# Altium project 2022_02_11_LED_Driver_PCB.PrjPcb
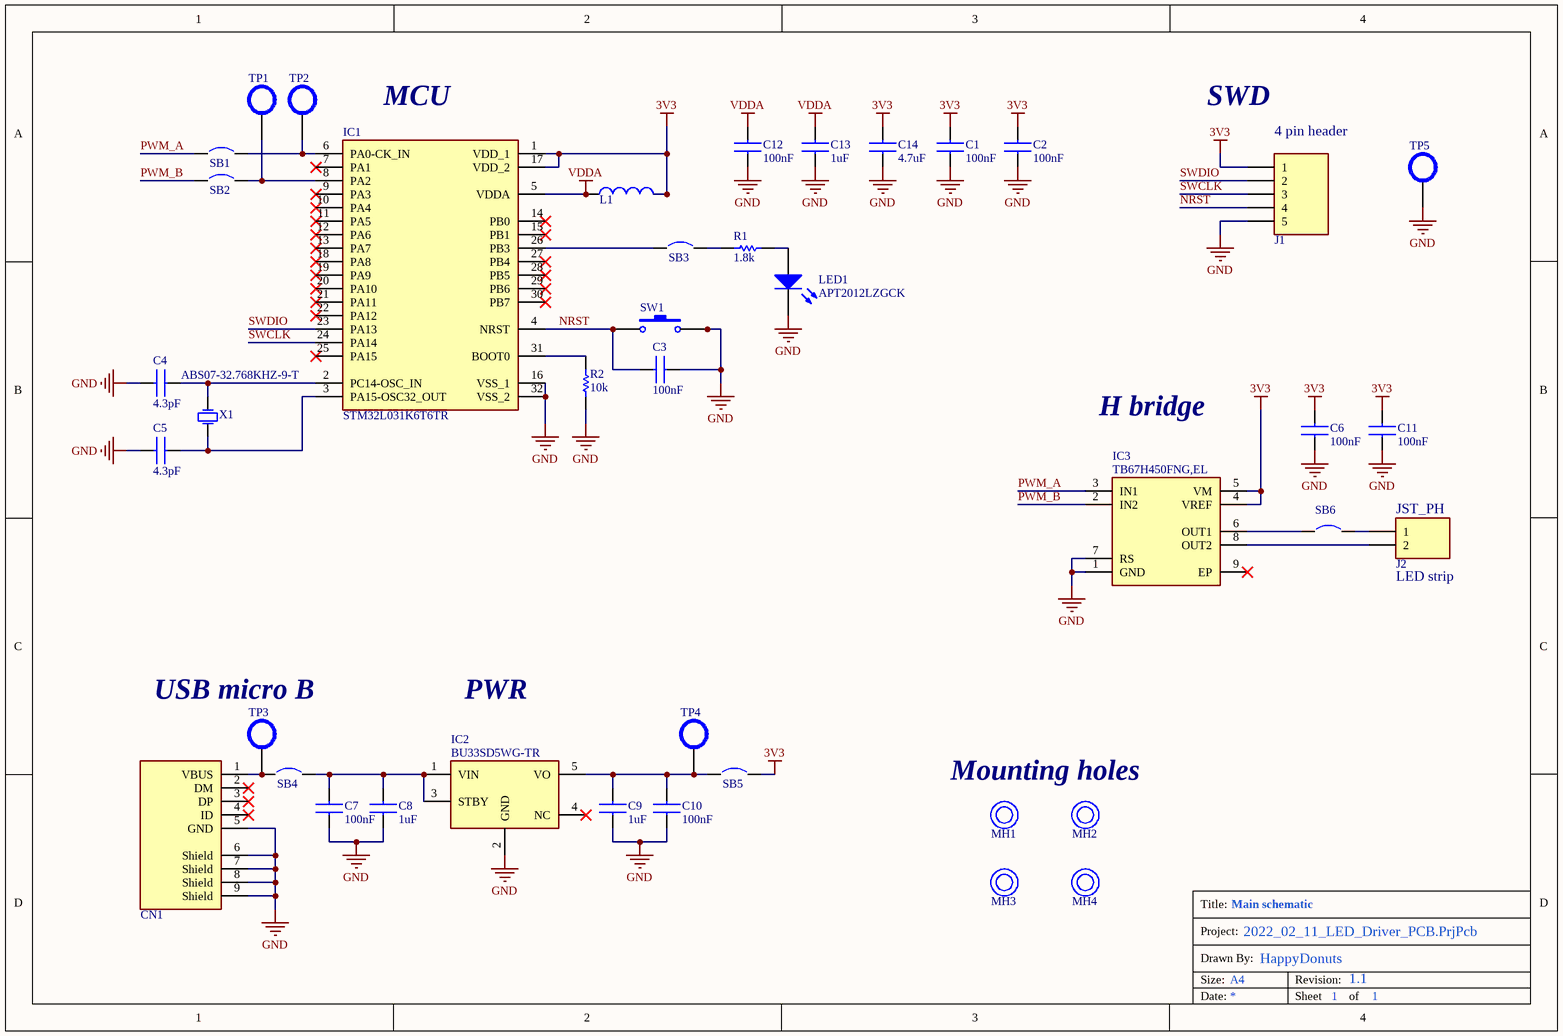
[diagram p0: main.SchDoc]
1 sheet, 41 parts. Net scope: global (net labels, ports and power ports of the same name join across sheets).
Board file: PCB1.PcbDoc

## Sheet main.SchDoc: Main schematic
size A4; Author: HappyDonuts; Revision: 1.1; SheetNumber: 1; SheetTotal: 1

### Parts
C1  value 100nF  [CAPC2012X94N]  (hidden comment: C0805C104K5RAC7411)
C2  value 100nF  [CAPC2012X94N]  (hidden comment: C0805C104K5RAC7411)
C3  value 100nF  [CAPC2012X94N]  (hidden comment: C0805C104K5RAC7411)
C4  value 4.3pF  [CAPC2012X94N]  (hidden comment: 08055A4R3CAT2A)
C5  value 4.3pF  [CAPC2012X94N]  (hidden comment: 08055A4R3CAT2A)
C6  value 100nF  [CAPC2012X94N]  (hidden comment: C0805C104K5RAC7411)
C7  value 100nF  [CAPC2012X94N]  (hidden comment: C0805C104K5RAC7411)
C8  value 1uF  [CAPC2012X135N]  (hidden comment: 885012107015)
C9  value 1uF  [CAPC2012X135N]  (hidden comment: 885012107015)
C10  value 100nF  [CAPC2012X94N]  (hidden comment: C0805C104K5RAC7411)
C11  value 100nF  [CAPC2012X94N]  (hidden comment: C0805C104K5RAC7411)
C12  value 100nF  [CAPC2012X94N]  (hidden comment: C0805C104K5RAC7411)
C13  value 1uF  [CAPC2012X135N]  (hidden comment: 885012107015)
C14  value 4.7uF  [CAPC2012X135N]  (hidden comment: CL21A475KPFNNNE)
CN1  920-E52A2021S10100  [USB307530A]  (value not drawn)
IC1  STM32L031K6T6TR  [QFP80P900X900X160-32N]
IC2  BU33SD5WG-TR  [SOT95P280X125-5N]
IC3  TB67H450FNG,EL  [SOIC127P600X175-9N]
J1  5PIN  [5PIN]  (value not drawn)
J2  B2B-PH-K-S_LF__SN_  [SHDR2W50P0X200_1X2_590X450X600P]  (value not drawn)
L1  742792030  [RESC2012X60N]  (value not drawn)
LED1  APT2012LZGCK  [LEDC2012X85N]
MH1  MOUNTING_HOLE_NP  [MOUNTING_HOLE_NP]  (value not drawn)  (no BOM)
MH2  MOUNTING_HOLE_NP  [MOUNTING_HOLE_NP]  (value not drawn)  (no BOM)
MH3  MOUNTING_HOLE_NP  [MOUNTING_HOLE_NP]  (value not drawn)  (no BOM)
MH4  MOUNTING_HOLE_NP  [MOUNTING_HOLE_NP]  (value not drawn)  (no BOM)
R1  value 1.8k  [RESC2012X60N]  (hidden comment: RC0805FR-071K8L)
R2  value 10k  [RESC2012X60N]  (hidden comment: RC0805FR-0710KL)
SB1  RC0805FR-070RL  [RESC2012X60N]  (value not drawn)
SB2  RC0805FR-070RL  [RESC2012X60N]  (value not drawn)
SB3  RC0805FR-070RL  [RESC2012X60N]  (value not drawn)
SB4  RC0805FR-070RL  [RESC2012X60N]  (value not drawn)
SB5  RC0805FR-070RL  [RESC2012X60N]  (value not drawn)
SB6  RC0805FR-070RL  [RESC2012X60N]  (value not drawn)
SW1  EVP-BT3G4A000  [EVP-BT3G4A000]  (value not drawn)
TP1  TEST_POINT  [TEST_POINT]  (value not drawn)  (no BOM)
TP2  TEST_POINT  [TEST_POINT]  (value not drawn)  (no BOM)
TP3  TEST_POINT  [TEST_POINT]  (value not drawn)  (no BOM)
TP4  TEST_POINT  [TEST_POINT]  (value not drawn)  (no BOM)
TP5  TEST_POINT  [TEST_POINT]  (value not drawn)  (no BOM)
X1  ABS07-32.768KHZ-9-T  [ABS-07]

### Nets
3V3: C1.2 C2.2 C6.2 C11.2 C14.2 IC1.1(VDD_1) IC1.17(VDD_2) IC3.4(VREF) IC3.5(VM) J1.1 L1.2 SB5.2
GND: C1.1 C2.1 C3.2 C4.1 C5.1 C6.1 C7.1 C8.1 C9.1 C10.1 C11.1 C12.1 C13.1 C14.1 CN1.5(GND) CN1.6(Shield) CN1.7(Shield) CN1.8(Shield) CN1.9(Shield) IC1.16(VSS_1) IC1.32(VSS_2) IC2.2(GND) IC3.1(GND) IC3.7(RS) J1.5 LED1.2(A) R2.1 SW1.3 SW1.4 TP5.TP
VDDA: C12.2 C13.2 IC1.5(VDDA) L1.1
NRST: C3.1 IC1.4(NRST) J1.4 SW1.1 SW1.2
PWM_A: IC3.3(IN1) SB1.1
PWM_B: IC3.2(IN2) SB2.1
SWCLK: IC1.24(PA14) J1.3
SWDIO: IC1.23(PA13) J1.2
NetC4_2: C4.2 IC1.2(PC14-OSC_IN) X1.2
NetC5_2: C5.2 IC1.3(PA15-OSC32_OUT) X1.1
NetC7_2: C7.2 C8.2 IC2.1(VIN) IC2.3(STBY) SB4.2
NetC9_2: C9.2 C10.2 IC2.5(VO) SB5.1 TP4.TP
NetCN1_1: CN1.1(VBUS) SB4.1 TP3.TP
NetIC1_6: IC1.6(PA0-CK_IN) SB1.2 TP2.TP
NetIC1_8: IC1.8(PA2) SB2.2 TP1.TP
NetIC1_26: IC1.26(PB3) SB3.1
NetIC1_31: IC1.31(BOOT0) R2.2
NetIC3_6: IC3.6(OUT1) SB6.1
NetIC3_8: IC3.8(OUT2) J2.2
NetJ2_1: J2.1 SB6.2
NetLED1_1: LED1.1(K) R1.2
NetR1_1: R1.1 SB3.2

Not connected (* = marked no-connect by the designer): CN1 2(DM)* 3(DP)* 4(ID)*; IC1 7(PA1)* 9(PA3)* 10(PA4)* 11(PA5)* 12(PA6)* 13(PA7)* 14(PB0)* 15(PB1)* 18(PA8)* 19(PA9)* 20(PA10)* 21(PA11)* 22(PA12)* 25(PA15)* 27(PB4)* 28(PB5)* 29(PB6)* 30(PB7)*; IC2 4(NC)*; IC3 9(EP)*

### Notes on the sheet
- (near IC1) MCU
- SWD
- (near J1) 4 pin header
- H bridge
- (near J2) JST_PH
- (near J2) LED strip
- (near TP3) USB micro B
- PWR
- Mounting holes
- Title:
- Size:
- Date:
- Drawn By:
- Project:
- A4
- Revision:
- Sheet
- of

### Library data of the parts
C1-C3 C6 C7 C10-C12 = C0805C104K5RAC7411: Capacitor; Manufacturer_Name: Kemet; Datasheet Link: https://www.mouser.com/datasheet/2/212/KEM_C1002_X7R_SMD-1102033.pdf; Height: 0.88mm; Manufacturer_Part_Number: C0805C104K5RAC7411; Mouser Part Number: 80-C0805C104K5RACLR; Mouser Price/Stock: https://www.mouser.co.uk/ProductDetail/KEMET/C0805C104K5RAC7411?qs=jbRM9o5BbzPcVXF0wW9AYg%3D%3D; Arrow Part Number: C0805C104K5RAC7411; Arrow Price/Stock: https://www.arrow.com/en/products/c0805c104k5rac7411/kemet-corporation
C4 C5 = 08055A4R3CAT2A: Capacitor; Manufacturer_Name: AVX; Datasheet Link: http://datasheets.avx.com/C0GNP0-Dielectric.pdf; Height: 0.94mm; Manufacturer_Part_Number: 08055A4R3CAT2A
C8 C9 C13 = 885012107015: Capacitor; Manufacturer_Name: Wurth Elektronik; Datasheet Link: https://katalog.we-online.com/pbs/datasheet/885012107015.pdf; Height: 1.35mm; Manufacturer_Part_Number: 885012107015; Mouser Part Number: 710-885012107015; Mouser Price/Stock: https://www.mouser.co.uk/ProductDetail/Wurth-Elektronik/885012107015?qs=0KOYDY2FL2%252BNQREZP%252BtVoQ%3D%3D
C14 = CL21A475KPFNNNE: Capacitor; Manufacturer_Name: Wurth Elektronik; Datasheet Link: https://www.mouser.fr/datasheet/2/585/MLCC-1837944.pdf; Height: 1.35mm; Manufacturer_Part_Number: CL21A475KPFNNNE; Mouser Part Number: 187-CL21A475KPFNNNE; Mouser Price/Stock: https://www.mouser.co.uk/ProductDetail/Wurth-Elektronik/885012107015?qs=0KOYDY2FL2%252BNQREZP%252BtVoQ%3D%3D
CN1 = 920-E52A2021S10100: USB connector; Manufacturer_Name: Jing Extension of the Electronic Co.; Datasheet Link: http://toshiba.semicon-storage.com/info/docget.jsp?did=65346&prodName=TB67H450FNG; Height: 1.9mm; Manufacturer_Part_Number: https://datasheet.lcsc.com/lcsc/2103051832_Jing-Extension-of-the-Electronic-Co--920-E52A2021S10100_C10418.pdf; Mouser Part Number: 920-E52A2021S10100; Mouser Price/Stock: https://www.mouser.co.uk/ProductDetail/Toshiba/TB67H450FNGEL?qs=h6V4JsTaLXeReNg2bp0jug%3D%3D; Arrow Part Number: TB67H450FNG,EL; Arrow Price/Stock: https://www.arrow.com/en/products/tb67h450fngel/toshiba?region=nac
IC1 = STM32L031K6T6TR: Integrated Circuit; Manufacturer_Name: STMicroelectronics; Datasheet Link: https://www.mouser.fr/datasheet/2/389/dm00140359-1798360.pdf; Height: 1.6mm; Manufacturer_Part_Number: STM32L031K6T6TR; Mouser Part Number: 511-STM32L031K6T6TR; Mouser Price/Stock: https://www.mouser.co.uk/ProductDetail/STMicroelectronics/STM32L031K6T6?qs=mwoc%252BQmZlGIAMyWzQ3GanA%3D%3D; Arrow Part Number: STM32L031K6T6; Arrow Price/Stock: https://www.arrow.com/en/products/stm32l031k6t6/stmicroelectronics?region=nac
IC2 = BU33SD5WG-TR: Power Supply; Manufacturer_Name: ROHM Semiconductor; Datasheet Link: https://componentsearchengine.com/Datasheets/1/BU33SD5WG-TR.pdf; Height: 1.25mm; Manufacturer_Part_Number: BU33SD5WG-TR; Mouser Part Number: 755-BU33SD5WG-TR; Mouser Price/Stock: https://www.mouser.co.uk/ProductDetail/ROHM-Semiconductor/BU33SD5WG-TR?qs=%2FKR40Cd6GUrQDzRkUEt69Q%3D%3D
IC3 = TB67H450FNG,EL: Integrated Circuit; Manufacturer_Name: Toshiba; Datasheet Link: http://toshiba.semicon-storage.com/info/docget.jsp?did=65346&prodName=TB67H450FNG; Height: 1.75mm; Manufacturer_Part_Number: TB67H450FNG,EL; Mouser Part Number: 757-TB67H450FNGEL; Mouser Price/Stock: https://www.mouser.co.uk/ProductDetail/Toshiba/TB67H450FNGEL?qs=h6V4JsTaLXeReNg2bp0jug%3D%3D; Arrow Part Number: TB67H450FNG,EL; Arrow Price/Stock: https://www.arrow.com/en/products/tb67h450fngel/toshiba?region=nac
J1 = 5PIN: Connector
J2 = B2B-PH-K-S_LF__SN_: Connector; Manufacturer_Name: JST (JAPAN SOLDERLESS TERMINALS); Manufacturer_Part_Number: B2B-PH-K-S(LF)(SN); Datasheet Link: https://datasheet.lcsc.com/szlcsc/JST-Sales-America-B2B-PH-K-S-LF-SN_C131337.pdf; Height: 6mm; Arrow Part Number: B2B-PH-K-S(LF)(SN); Arrow Price/Stock: https://www.arrow.com/en/products/b2b-ph-k-s-lf-sn/jst-manufacturing
L1 = 742792030: Inductor; Manufacturer_Name: Wurth Elektronik; Datasheet Link: https://www.mouser.fr/datasheet/2/445/742792030-2449195.pdf; Height: 0.6mm; Manufacturer_Part_Number: 742792030
LED1 = APT2012LZGCK: LED; Manufacturer_Name: Kingbright; Datasheet Link: http://www.kingbrightusa.com/images/catalog/SPEC/APT2012LZGCK.pdf; Height: 0.85mm; Manufacturer_Part_Number: APT2012LZGCK; Mouser Part Number: 604-APT2012LZGCK; Mouser Price/Stock: https://www.mouser.co.uk/ProductDetail/Kingbright/APT2012LZGCK?qs=6oMev5NRZMHOosFiXb%2F3qw%3D%3D; Arrow Part Number: APT2012LZGCK; Arrow Price/Stock: https://www.arrow.com/en/products/apt2012lzgck/kingbright
MH1-MH4 = MOUNTING_HOLE_NP: Mounting hole
R1 = RC0805FR-071K8L: Resistor; Manufacturer_Name: YAGEO (PHYCOMP); Datasheet Link: https://datasheet.datasheetarchive.com/originals/distributors/Datasheets_SAMA/902f9e387b938f871d31120f5fc1d65e.pdf; Height: 0.6mm; Manufacturer_Part_Number: RC0805FR-071K8L; Mouser Part Number: 603-RC0805FR-071K8L; Mouser Price/Stock: https://www.mouser.co.uk/ProductDetail/Yageo/RC0805FR-071K8L/?qs=BrN8wpjQTgHgSGvPYmemsg%3D%3D
R2 = RC0805FR-0710KL: Resistor; Manufacturer_Name: YAGEO (PHYCOMP); Datasheet Link: https://datasheet.datasheetarchive.com/originals/distributors/Datasheets_SAMA/902f9e387b938f871d31120f5fc1d65e.pdf; Height: 0.6mm; Manufacturer_Part_Number: RC0805FR-0710KL; Mouser Part Number: 603-RC0805FR-0710KL; Mouser Price/Stock: https://www.mouser.co.uk/ProductDetail/YAGEO/RC0805FR-0710KL?qs=7bY8808IzHq6vrU3BeiiYw%3D%3D; Arrow Part Number: RC0805FR-0710KL; Arrow Price/Stock: https://www.arrow.com/en/products/rc0805fr-0710kl/yageo?region=europe
SB1-SB6 = RC0805FR-070RL: Jumper (0 ohm); Manufacturer_Name: YAGEO (PHYCOMP); Datasheet Link: https://datasheet.datasheetarchive.com/originals/distributors/Datasheets_SAMA/902f9e387b938f871d31120f5fc1d65e.pdf; Height: 0.6mm; Manufacturer_Part_Number: RC0805FR-070RL; Mouser Part Number: 603-RC0805FR-070RL; Mouser Price/Stock: https://www.mouser.co.uk/ProductDetail/YAGEO/RC0805FR-070RL?qs=fRxXYNj8ftF6kXqh1XbZJQ%3D%3D
SW1 = EVP-BT3G4A000: Tactile switch; Manufacturer_Name: Panasonic; Datasheet Link: https://www.mouser.fr/datasheet/2/315/sw_lt_eng_6s_th-2889044.pdf; Height: 3.1mm; Manufacturer_Part_Number: EVP-BT3G4A000
TP1-TP5 = TEST_POINT: Test point
X1 = ABS07-32.768KHZ-9-T: Crystal; Manufacturer_Name: ABRACON; Datasheet Link: http://www.abracon.com/Resonators/ABS07.pdf; Manufacturer_Part_Number: ABS07-32.768KHZ-9-T; Mouser Part Number: 815-ABS07-32.768K9T; Mouser Price/Stock: https://www.mouser.co.uk/ProductDetail/ABRACON/ABS07-32768KHZ-9-T?qs=2nyfZ6BV3ogTQgR0mYqaug%3D%3D; Arrow Part Number: ABS07-32.768KHZ-9-T; Arrow Price/Stock: https://www.arrow.com/en/products/abs07-32.768khz-9-t/abracon?region=nac